# Altium schematic sheet FR120N-MODULE_2025-03-19.schdoc
size 48 x 53 mm
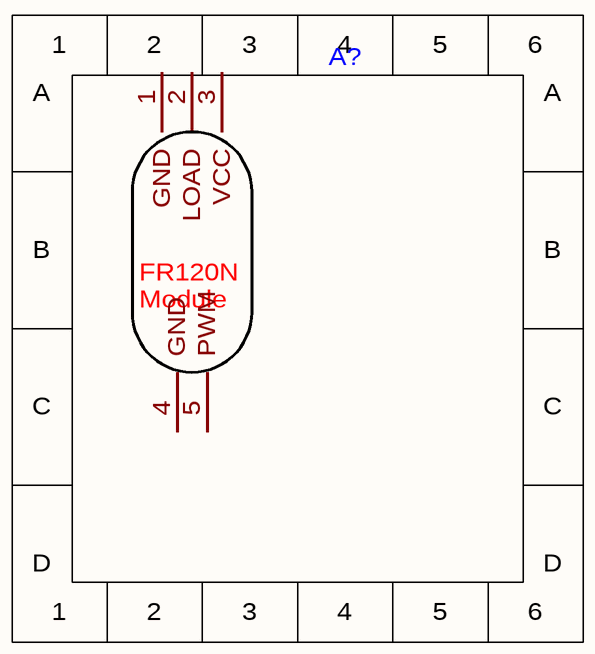
[diagram p0: FR120N-MODULE_2025-03-19.schdoc]

## Parts
A?  (no value)  [LR7843]

## Nets

Not connected (* = marked no-connect by the designer): A? 1(GND) 2(LOAD) 3(VCC) 4(GND) 5(PWM)

## Notes on the sheet
- (in symbol FR120N-MODULE) FR120N / Module

## Library data of the parts
A? = FR120N-MODULE